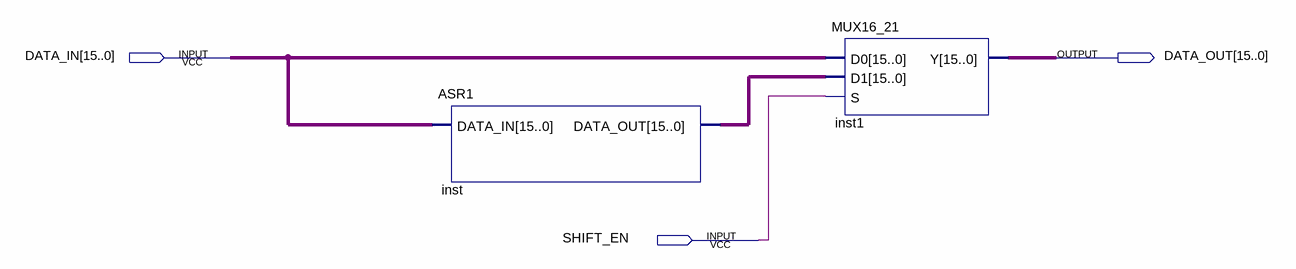
[diagram p0: schematic sheet]
// Quartus schematic SHIFTER_STAGE0.bdf as structural Verilog: 2 symbols, 3 pins
module SHIFTER_STAGE0 (
  input  [15:0] DATA_IN,
  input  SHIFT_EN,
  output [15:0] DATA_OUT
);

  wire [15:0] inst_data_out;

  ASR1 inst (.DATA_IN(DATA_IN), .DATA_OUT(inst_data_out));
  MUX16_21 inst1 (.D0(DATA_IN), .D1(inst_data_out), .S(SHIFT_EN), .Y(DATA_OUT));
endmodule
